# EAGLE schematic PIC12F675P Breakout Board (EAGLE 6.4)
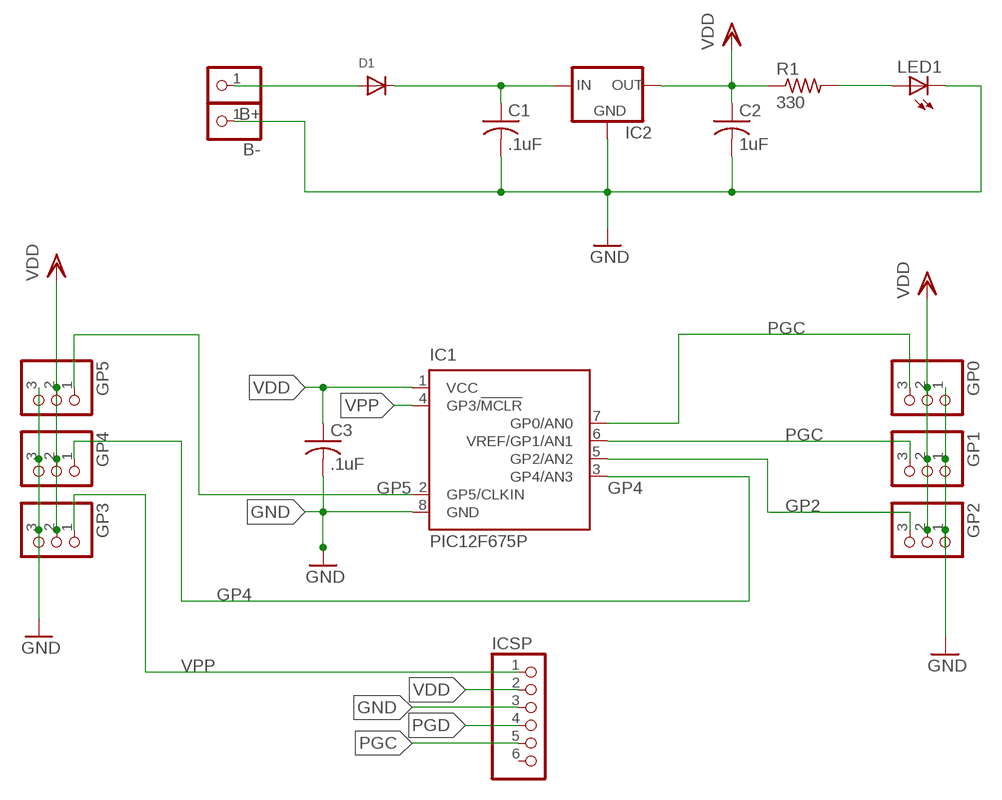
[diagram p0: schematic, sheet 1]

## Parts
B+  PINHD-1X1  [1X01]
B-  PINHD-1X1  [1X01]
C1  .1uF  C-USC0805  [C0805]
C2  1uF  C-USC0805  [C0805]
C3  .1uF  C-USC0805  [C0805]
D1  DIODESMA  [SMADIODE]
GP0  PINHD-1X3  [1X03]
GP1  PINHD-1X3  [1X03]
GP2  PINHD-1X3  [1X03]
GP3  PINHD-1X3  [1X03]
GP4  PINHD-1X3  [1X03]
GP5  PINHD-1X3  [1X03]
IC1  PIC12F675P  [DIL8]
IC2  78XXL  [78XXL]
ICSP  PINHD-1X6  [1X06]
LED1  LEDSML0805  [SML0805]
R1  330  R-US_R0805  [R0805]

## Nets
GND: B-.1 C1.2 C2.2 C3.2 GP0.1 GP1.1 GP2.1 GP3.3 GP4.3 GP5.3 IC1.8(GND) IC2.GND ICSP.3 LED1.C
GP2: GP2.3 IC1.5(GP2/AN2)
GP4: GP4.1 IC1.3(GP4/AN3)
GP5: GP5.1 IC1.2(GP5/CLKIN)
N$1: B+.1 D1.A
N$2: LED1.A R1.2
N$3: C1.1 D1.C IC2.IN
PGC: GP0.3 GP1.3 IC1.6(VREF/GP1/AN1) IC1.7(GP0/AN0) ICSP.5
PGD: ICSP.4
VDD: C2.1 C3.1 GP0.2 GP1.2 GP2.2 GP3.2 GP4.2 GP5.2 IC1.1(VCC) IC2.OUT ICSP.2 R1.1
VPP: GP3.1 IC1.4(GP3/!MCLR) ICSP.1
Unconnected: ICSP.6

## Library data of the parts
B+ B- = adafruit:PINHD-1X1: Pin header 1x1 for 0.1" spacing With round pins
C1-C3 = adafruit:C-US: CAPACITOR, American symbol
D1 = adafruit:DIODE: Diode SMADIODE - SMA Surface Mount Package 20V 1A Schottky Diode Digikey: 641-1014-6-ND DO-1N4148 - Through Hole Small Current Diode SOD-123 20V 1 A (.5mV Vf) Schottky Diode - Digikey: MBRX120TPMSCT-ND SOD-323 10V 570mA (.38mV Vf, 3ns) Schottky Diode - Digikey: ZLLS410CT-ND SOD-523 30V 30mA Schottky Diode (RB751S-40TE61) - Digikey: RB751S-40TE61CT-ND SOT23-R/W - SOT23 Package (R = Solder Paste/Reflow Ovens, W = Hand-Soldering) BAT54Film 40V 300mA - Digikey: 497-7162-1-ND
GP0 GP1-GP5 = adafruit:PINHD-1X3: PIN HEADER
IC1 = microchip:PIC12F675: 8-Pin FLASH-Based 8-Bit CMOS Microcontroller Precision Internal 4 MHz oscillator factory calibrated to ±1% Low Power Features: Standby Current: - 1 nA @ 2.0V, typical Operating Current: - 8.5µA @ 32 kHz, 2.0V, typical - 100µA @ 1 MHz, 2.0V, typical Watchdog Timer Current: - 300 nA @ 2.0V, typical Timer1 oscillator current: - 4µA @ 32 kHz, 2.0V, typical Analog-to-Digital Converter module: - 10-bit resolution - Programmable 4-channel input - Voltage reference input Source: http://www.microchip.com .. 41190E.pdf; MF: MICROCHIP; MPN: PIC12F675-E/P; OC_FARNELL: 9759018; OC_NEWARK: 92C4340
IC2 = v-reg:78XXL: VOLTAGE REGULATOR
ICSP = adafruit:PINHD-1X6: PIN HEADER
LED1 = led:LED: LED OSRAM: - CHIPLED LG R971, LG N971, LY N971, LG Q971, LY Q971, LO R971, LY R971 LH N974, LH R974 LS Q976, LO Q976, LY Q976 LO Q996 - Hyper CHIPLED LW Q18S LB Q993, LB Q99A, LB R99A - SideLED LS A670, LO A670, LY A670, LG A670, LP A670 LB A673, LV A673, LT A673, LW A673 LH A674 LY A675 LS A676, LA A676, LO A676, LY A676, LW A676 LS A679, LY A679, LG A679 - Hyper Micro SIDELED® LS Y876, LA Y876, LO Y876, LY Y876 LT Y87S - SmartLED LW L88C, LW L88S LB L89C, LB L89S, LG L890 LS L89K, LO L89K, LY L89K LS L896, LA L896, LO L896, LY L896 - TOPLED LS T670, LO T670, LY T670, LG T670, LP T670 LSG T670, LSP T670, LSY T670, LOP T670, LYG T670 LG T671, LOG T671, LSG T671 LB T673, LV T673, LT T673, LW T673 LH T674 LS T676, LA T676, LO T676, LY T676, LB T676, LH T676, LSB T676, LW T676 LB T67C, LV T67C, LT T67C, LS T67K, LO T67K, LY T67K, LW E67C LS E67B, LA E67B, LO E67B, LY E67B, LB E67C, LV E67C, LT E67C LW T67C LS T679, LY T679, LG T679 LS T770, LO T770, LY T770, LG T770, LP T770 LB T773, LV T773, LT T773, LW T773 LH T774 LS E675, LA E675, LY E675, LS T675 LS T776, LA T776, LO T776, LY T776, LB T776 LHGB T686 LT T68C, LB T68C - Hyper Mini TOPLED® LB M676 - Mini TOPLED Santana® LG M470 LS M47K, LO M47K, LY M47K Source: http://www.osram.convergy.de LUXEON: - LUMILED® LXK2-PW12-R00, LXK2-PW12-S00, LXK2-PW14-U00, LXK2-PW14-V00 LXK2-PM12-R00, LXK2-PM12-S00, LXK2-PM14-U00 LXK2-PE12-Q00, LXK2-PE12-R00, LXK2-PE12-S00, LXK2-PE14-T00, LXK2-PE14-U00 LXK2-PB12-K00, LXK2-PB12-L00, LXK2-PB12-M00, LXK2-PB14-N00, LXK2-PB14-P00, LXK2-PB14-Q00 LXK2-PR12-L00, LXK2-PR12-M00, LXK2-PR14-Q00, LXK2-PR14-R00 LXK2-PD12-Q00, LXK2-PD12-R00, LXK2-PD12-S00 LXK2-PH12-R00, LXK2-PH12-S00 LXK2-PL12-P00, LXK2-PL12-Q00, LXK2-PL12-R00 Source: www.luxeon.com KINGBRIGHT: KA-3528ASYC Source: www.kingbright.com
R1 = rcl:R-US_: RESISTOR, American symbol